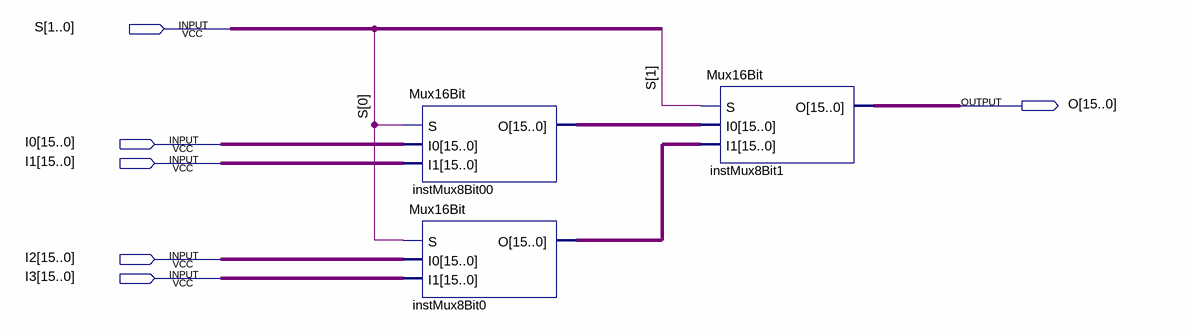
[diagram p0: schematic sheet]
// Quartus schematic Mux16Bit4To1.bdf as structural Verilog: 3 symbols, 6 pins
module Mux16Bit4To1 (
  input  [1:0] S,
  input  [15:0] I0,
  input  [15:0] I1,
  input  [15:0] I2,
  input  [15:0] I3,
  output [15:0] O
);

  wire [15:0] instMux8Bit00_o, instMux8Bit0_o;

  Mux16Bit instMux8Bit00 (.S(S[0]), .I0(I0), .I1(I1), .O(instMux8Bit00_o));
  Mux16Bit instMux8Bit0 (.S(S[0]), .I0(I2), .I1(I3), .O(instMux8Bit0_o));
  Mux16Bit instMux8Bit1 (.S(S[1]), .I0(instMux8Bit00_o), .I1(instMux8Bit0_o), .O(O));
endmodule
